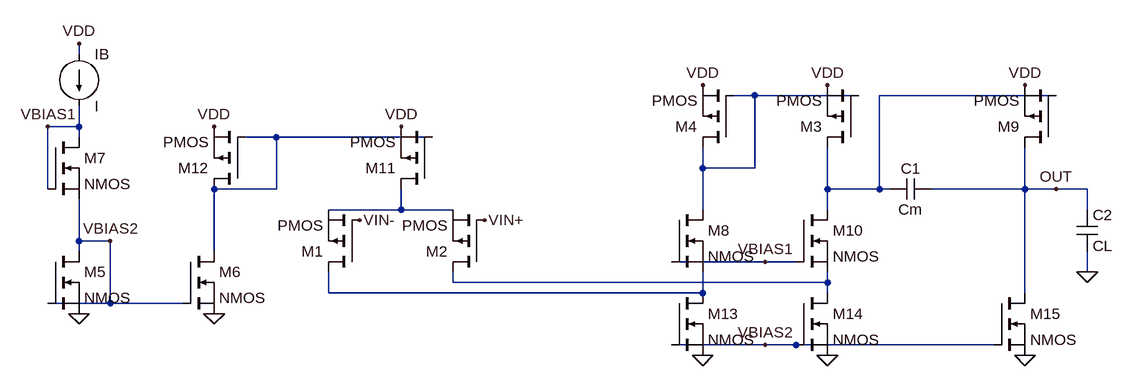
[diagram p0: schematic essai.asc]
essai.asc, the LTspice schematic file:
Version 4
SHEET 1 1352 840
WIRE -256 -128 -256 -144
WIRE 784 -64 752 -64
WIRE 944 -64 784 -64
WIRE 1248 -64 976 -64
WIRE -256 -16 -256 -48
WIRE -256 -16 -304 -16
WIRE -256 0 -256 -16
WIRE 48 0 0 0
WIRE 288 0 48 0
WIRE 704 48 704 16
WIRE 784 48 784 -64
WIRE 784 48 704 48
WIRE -304 80 -304 -16
WIRE 48 80 48 0
WIRE 48 80 -48 80
WIRE 896 80 896 16
WIRE 976 80 976 -64
WIRE 976 80 896 80
WIRE 992 80 976 80
WIRE 1200 80 1200 16
WIRE 1200 80 1056 80
WIRE 1248 80 1200 80
WIRE 1296 80 1248 80
WIRE 240 112 240 80
WIRE 240 112 128 112
WIRE 320 112 240 112
WIRE 704 112 704 48
WIRE 896 112 896 80
WIRE 1296 112 1296 80
WIRE -256 160 -256 96
WIRE -208 160 -256 160
WIRE -256 176 -256 160
WIRE -48 176 -48 80
WIRE 800 192 656 192
WIRE 848 192 800 192
WIRE 1296 208 1296 176
WIRE 320 224 320 208
WIRE 896 224 896 208
WIRE 896 224 320 224
WIRE 128 240 128 208
WIRE 704 240 704 208
WIRE 704 240 128 240
WIRE 896 240 896 224
WIRE 1200 240 1200 80
WIRE -208 256 -208 160
WIRE -208 256 -304 256
WIRE -96 256 -208 256
WIRE 800 320 656 320
WIRE 848 320 800 320
WIRE 1152 320 848 320
FLAG 176 128 VIN-
FLAG 368 128 VIN+
FLAG 704 -80 VDD
FLAG 896 -80 VDD
FLAG 896 336 0
FLAG 704 336 0
FLAG 1200 -80 VDD
FLAG 1200 336 0
FLAG 1296 208 0
FLAG 240 -16 VDD
FLAG -48 -16 VDD
FLAG -256 272 0
FLAG -48 272 0
FLAG -256 -144 VDD
FLAG 1248 80 OUT
FLAG 800 192 VBIAS1
FLAG -304 -16 VBIAS1
FLAG 800 320 VBIAS2
FLAG -208 160 VBIAS2
SYMBOL pmos 176 208 R180
SYMATTR InstName M1
SYMBOL pmos 368 208 R180
SYMATTR InstName M2
SYMBOL pmos 944 16 R180
SYMATTR InstName M3
SYMBOL pmos 752 16 R180
SYMATTR InstName M4
SYMBOL pmos 1248 16 R180
SYMATTR InstName M9
SYMBOL cap 1056 64 R90
WINDOW 0 0 32 VBottom 2
WINDOW 3 32 32 VTop 2
SYMATTR InstName C1
SYMATTR Value Cm
SYMBOL cap 1280 112 R0
SYMATTR InstName C2
SYMATTR Value CL
SYMBOL pmos 288 80 R180
SYMATTR InstName M11
SYMBOL pmos 0 80 R180
SYMATTR InstName M12
SYMBOL current -256 -128 R0
SYMATTR InstName IB
SYMBOL nmos -304 176 R0
SYMATTR InstName M5
SYMBOL nmos -96 176 R0
SYMATTR InstName M6
SYMBOL nmos -304 0 R0
SYMATTR InstName M7
SYMBOL nmos 656 112 R0
SYMATTR InstName M8
SYMBOL nmos 848 112 R0
SYMATTR InstName M10
SYMBOL nmos 656 240 R0
SYMATTR InstName M13
SYMBOL nmos 848 240 R0
SYMATTR InstName M14
SYMBOL nmos 1152 240 R0
SYMATTR InstName M15

The netlist it stands for:
* essai.asc
M1 N006 VIN- N004 N004 PMOS
M2 N005 VIN+ N004 N004 PMOS
M3 N002 N001 VDD VDD PMOS
M4 N001 N001 VDD VDD PMOS
M9 OUT N002 VDD VDD PMOS
C1 OUT N002 Cm
C2 OUT 0 CL
M11 N004 N003 VDD VDD PMOS
M12 N003 N003 VDD VDD PMOS
IB VDD VBIAS1 I
M5 VBIAS2 VBIAS2 0 0 NMOS
M6 N003 VBIAS2 0 0 NMOS
M7 VBIAS1 VBIAS1 VBIAS2 VBIAS2 NMOS
M8 N001 VBIAS1 N006 N006 NMOS
M10 N002 VBIAS1 N005 N005 NMOS
M13 N006 VBIAS2 0 0 NMOS
M14 N005 VBIAS2 0 0 NMOS
M15 OUT VBIAS2 0 0 NMOS
.model NMOS NMOS
.model PMOS PMOS
.lib standard.mos
.backanno
.end